# Altium project umouse.PrjPcb
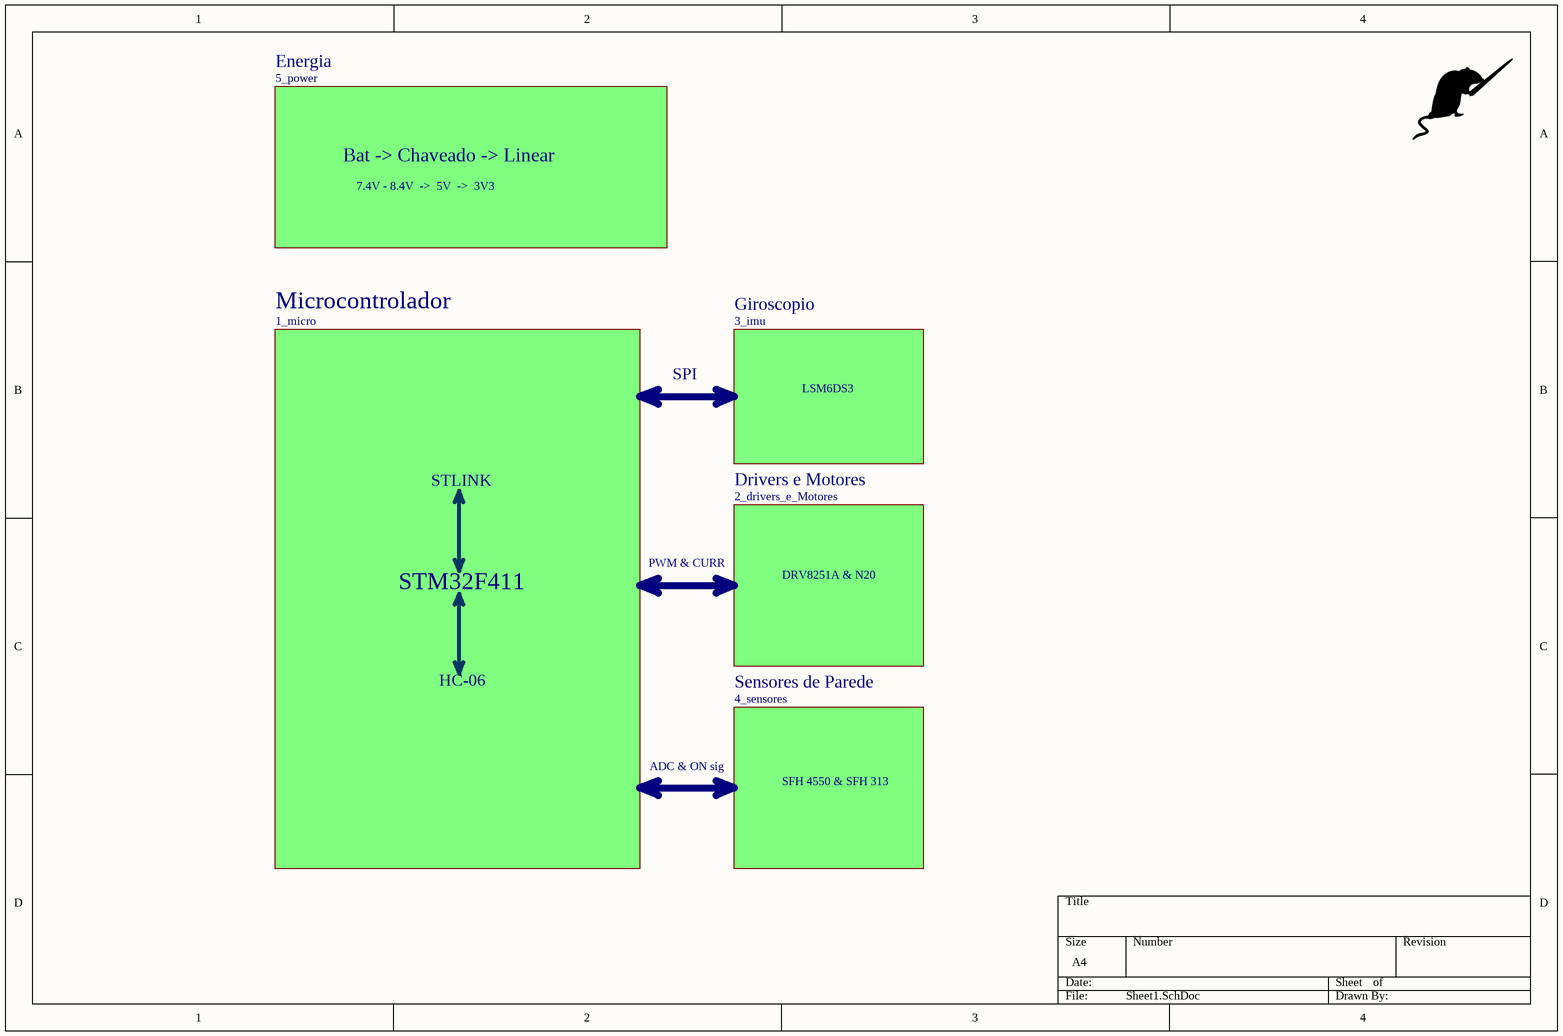
[diagram p0: Sheet1.SchDoc]
6 sheets, 80 parts. Net scope: flat (ports and power ports of the same name join across sheets).
Board files: initial.PcbDoc, atom-pcb.PcbDoc, v2.PcbDoc
Sheets:
  Sheet1.SchDoc
    Drivers e Motores = 2_drivers_e_Motores.SchDoc
    Microcontrolador = 1_micro.SchDoc
    Giroscopio = 3_imu.SchDoc
    Sensores de Parede = 4_sensores.SchDoc
    Energia = 5_power.SchDoc

## Sheet Sheet1.SchDoc
size A4; SheetNumber: 1; SheetTotal: 6

### Sub-sheets
Drivers e Motores = 2_drivers_e_Motores: no entries
Energia = 5_power: no entries
Giroscopio = 3_imu: no entries
Microcontrolador = 1_micro: no entries
Sensores de Parede = 4_sensores: no entries

### Notes on the sheet
- Bat -> Chaveado -> Linear
- 7.4V - 8.4V  ->  5V  ->  3V3
- SPI
- LSM6DS3
- STLINK
- PWM & CURR
- DRV8251A & N20
- STM32F411
- HC-06
- ADC & ON sig
- SFH 4550 & SFH 313

## Sheet 2_drivers_e_Motores.SchDoc: Teseu - Drivers
size A4; DocumentNumber: 2; Revision: 0.1; SheetNumber: 3; SheetTotal: 6
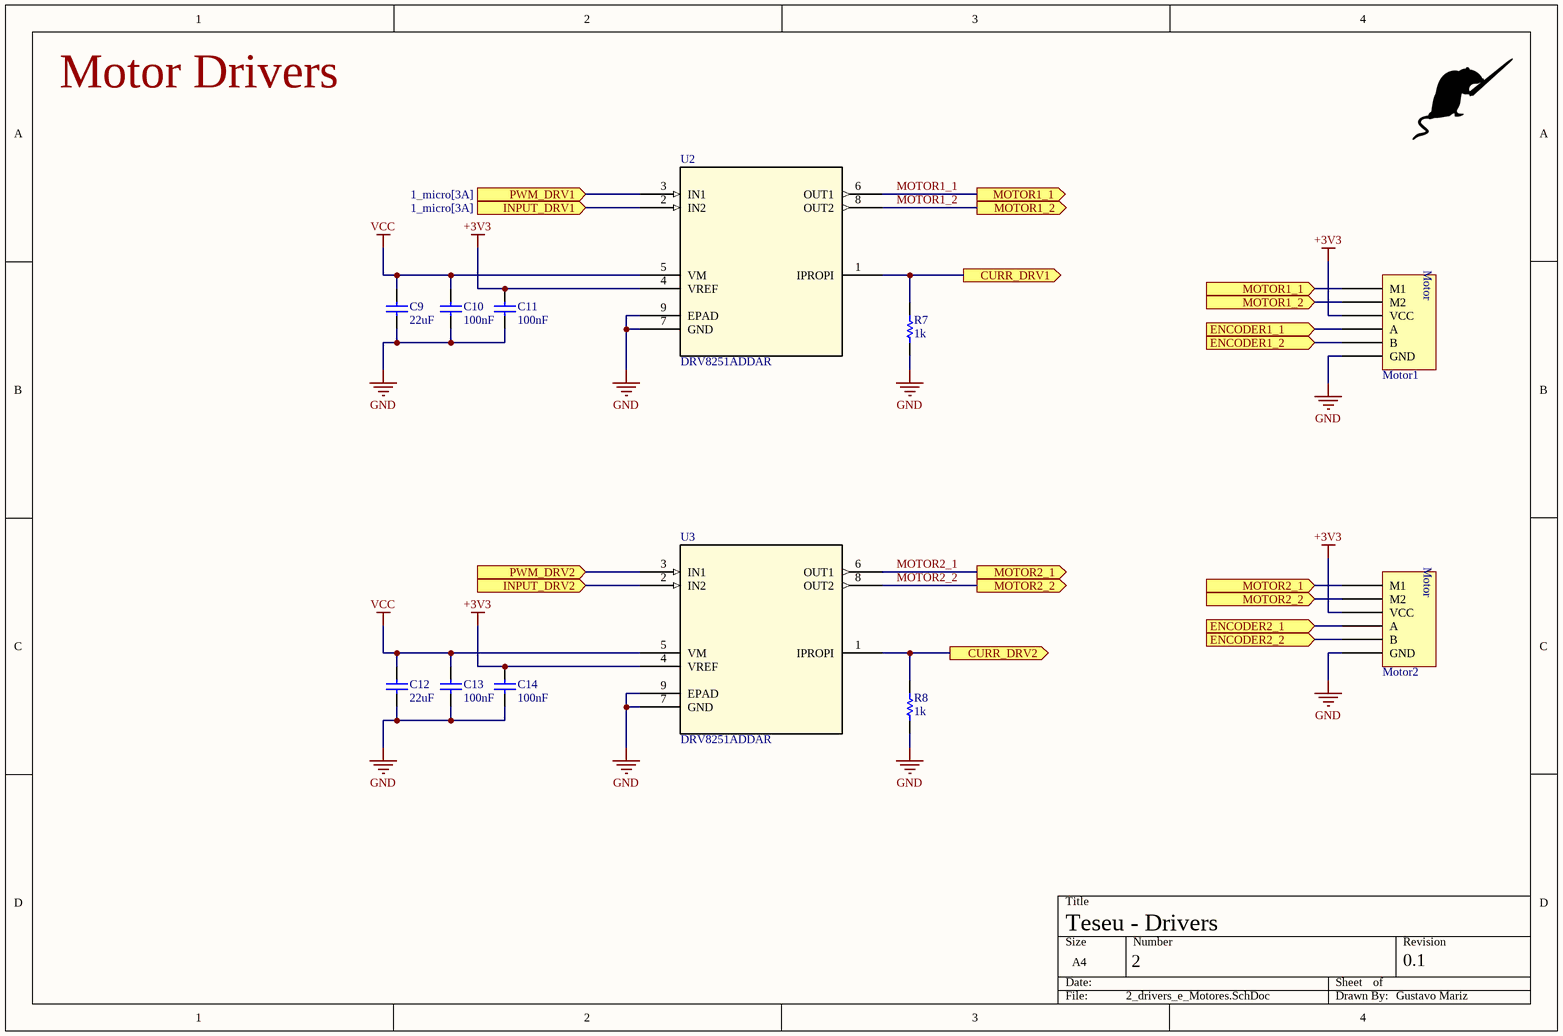
[diagram p1: 2_drivers_e_Motores.SchDoc]

### Parts
C9  Valor: 22uF  [CAP 0805]  (hidden comment: CAP)
C10  Valor: 100nF  [0603]  (hidden comment: CAP)
C11  Valor: 100nF  [0603]  (hidden comment: CAP)
C12  Valor: 22uF  [CAP 0805]  (hidden comment: CAP)
C13  Valor: 100nF  [0603]  (hidden comment: CAP)
C14  Valor: 100nF  [0603]  (hidden comment: CAP)
Motor1  Micro Motor c/ Encoder  [Micro Metal c/ Encoder]  (value not drawn)
Motor2  Micro Motor c/ Encoder  [Micro Metal c/ Encoder]  (value not drawn)
R7  value 1k  [RES 0603]  (hidden comment: RESISTOR)
R8  value 1k  [RES 0603]  (hidden comment: RESISTOR)
U2  DRV8251ADDAR  [SOIC8_DDA_TEX]
U3  DRV8251ADDAR  [SOIC8_DDA_TEX]

### Ports
CURR_DRV1 (out, see 1_micro[2B]), CURR_DRV2 (out, see 1_micro[3A]), ENCODER1_1 (in, see 1_micro[3A]), ENCODER1_2 (in, see 1_micro[2B]), ENCODER2_1 (in, see 1_micro[2A]), ENCODER2_2 (in, see 1_micro[2A]), INPUT_DRV1 (in, see 1_micro[3A]), INPUT_DRV2 (in, see 1_micro[2B]), MOTOR1_1 (in, see 2_drivers_e_Motores[3A]), MOTOR1_1 (out, see 2_drivers_e_Motores[4B]), MOTOR1_2 (in, see 2_drivers_e_Motores[3A]), MOTOR1_2 (out, see 2_drivers_e_Motores[4B]), MOTOR2_1 (in, see 2_drivers_e_Motores[3C]), MOTOR2_1 (out, see 2_drivers_e_Motores[4C]), MOTOR2_2 (in, see 2_drivers_e_Motores[3C]), MOTOR2_2 (out, see 2_drivers_e_Motores[4C]), PWM_DRV1 (in, see 1_micro[3A]), PWM_DRV2 (in, see 1_micro[2B])

### Nets
+3V3: C11.2 C14.2 Motor1.4(VCC) Motor2.4(VCC) U2.4(VREF) U3.4(VREF)
GND: C9.1 C10.1 C11.1 C12.1 C13.1 C14.1 Motor1.1(GND) Motor2.1(GND) R7.1 R8.1 U2.7(GND) U2.9(EPAD) U3.7(GND) U3.9(EPAD)
VCC: C9.2 C10.2 C12.2 C13.2 U2.5(VM) U3.5(VM)
CURR_DRV1: R7.2 U2.1(IPROPI) ; port CURR_DRV1
CURR_DRV2: R8.2 U3.1(IPROPI) ; port CURR_DRV2
ENCODER1_1: Motor1.3(A) ; port ENCODER1_1
ENCODER1_2: Motor1.2(B) ; port ENCODER1_2
ENCODER2_1: Motor2.3(A) ; port ENCODER2_1
ENCODER2_2: Motor2.2(B) ; port ENCODER2_2
INPUT_DRV1: U2.2(IN2) ; port INPUT_DRV1
INPUT_DRV2: U3.2(IN2) ; port INPUT_DRV2
MOTOR1_1: Motor1.6(M1) U2.6(OUT1) ; port MOTOR1_1
MOTOR1_2: Motor1.5(M2) U2.8(OUT2) ; port MOTOR1_2
MOTOR2_1: Motor2.6(M1) U3.6(OUT1) ; port MOTOR2_1
MOTOR2_2: Motor2.5(M2) U3.8(OUT2) ; port MOTOR2_2
PWM_DRV1: U2.3(IN1) ; port PWM_DRV1
PWM_DRV2: U3.3(IN1) ; port PWM_DRV2

### Notes on the sheet
- Motor Drivers
- Gustavo Mariz
- (in symbol Micro Motor c/ Encoder) Motor

### Library data of the parts
C9-C14 = CAP. CERÂMICO: Capacitor; Criador por: Luigi Eduardo; Pertence a: Trincabotz; Criado em: 26/06/2012
U2 U3 = DRV8251ADDAR: No Description Available; Mfr_Name: Texas Instruments; RefDes: RefDes; Type: Type

## Sheet 1_micro.SchDoc: Teseu - MCU
size A4; Author: Gustavo Mariz; CompanyName: Trincabotz; DrawnBy: Gustavo Mariz; Engineer: Gustavo Mariz; Organization: Trincabotz; DocumentNumber: 1; Revision: 0.1; SheetNumber: 2; SheetTotal: 6
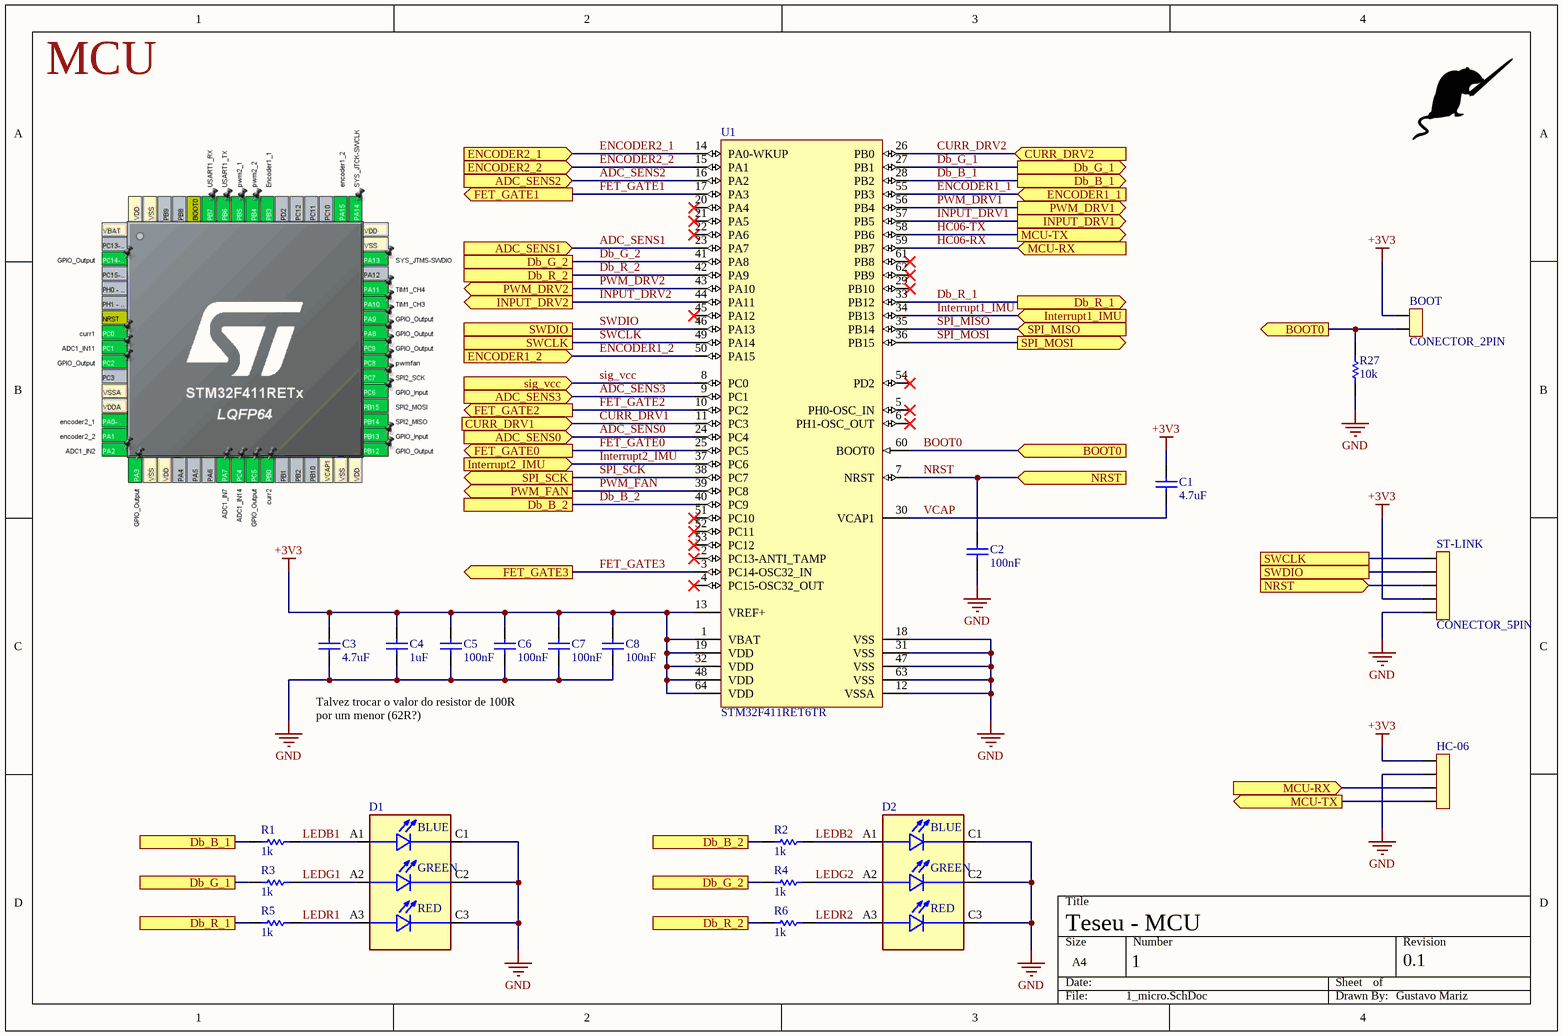
[diagram p2: 1_micro.SchDoc]

### Parts
BOOT  CONECTOR_2PIN  [CON2]
C1  Valor: 4.7uF  [0603]  (hidden comment: CAP)
C2  Valor: 100nF  [0603]  (hidden comment: CAP)
C3  Valor: 4.7uF  [0603]  (hidden comment: CAP)
C4  Valor: 1uF  [0603]  (hidden comment: CAP)
C5  Valor: 100nF  [0603]  (hidden comment: CAP)
C6  Valor: 100nF  [0603]  (hidden comment: CAP)
C7  Valor: 100nF  [0603]  (hidden comment: CAP)
C8  Valor: 100nF  [0603]  (hidden comment: CAP)
D1  KRTBLSLPS1.32-VUVX-EQ+BTBV-D8+TWTZ-L1-B  [LED_KRTBLSLPS1.32-VUVX-EQ+BTBV-D8+TWTZ-L1-B]  (value not drawn)
D2  KRTBLSLPS1.32-VUVX-EQ+BTBV-D8+TWTZ-L1-B  [LED_KRTBLSLPS1.32-VUVX-EQ+BTBV-D8+TWTZ-L1-B]  (value not drawn)
HC-06  (no value)  [CON4]
R1  value 1k  [RES 0603]  (hidden comment: RESISTOR)
R2  value 1k  [RES 0603]  (hidden comment: RESISTOR)
R3  value 1k  [RES 0603]  (hidden comment: RESISTOR)
R4  value 1k  [RES 0603]  (hidden comment: RESISTOR)
R5  value 1k  [RES 0603]  (hidden comment: RESISTOR)
R6  value 1k  [RES 0603]  (hidden comment: RESISTOR)
R27  value 10k  [RES 0805]  (hidden comment: RESISTOR)
ST-LINK  CONECTOR_5PIN  [CON5]
U1  STM32F411RET6TR  [STM-LQFP64_L]

### Ports
ADC_SENS0 (in, see 4_sensores[2B]), ADC_SENS1 (in, see 4_sensores[4B]), ADC_SENS2 (in, see 4_sensores[2C]), ADC_SENS3 (in, see 4_sensores[4C]), BOOT0 (in, see 1_micro[4B]), BOOT0 (out, see 1_micro[3B]), CURR_DRV1 (in, see 2_drivers_e_Motores[3B]), CURR_DRV2 (in, see 2_drivers_e_Motores[3C]), Db_B_1 (out, see 1_micro[1D]), Db_B_1 (see 1_micro[3A]), Db_B_2 (see 1_micro[2B]), Db_B_2 (see 1_micro[2D]), Db_G_1 (out, see 1_micro[1D]), Db_G_1 (see 1_micro[3A]), Db_G_2 (see 1_micro[2B]), Db_G_2 (see 1_micro[2D]), Db_R_1 (out, see 1_micro[1D]), Db_R_1 (see 1_micro[3B]), Db_R_2 (see 1_micro[2B]), Db_R_2 (see 1_micro[2D]), ENCODER1_1 (in, see 2_drivers_e_Motores[4B]), ENCODER1_2 (in, see 2_drivers_e_Motores[4B]), ENCODER2_1 (in, see 2_drivers_e_Motores[4C]), ENCODER2_2 (in, see 2_drivers_e_Motores[4C]), FET_GATE0 (out, see 4_sensores[1B]), FET_GATE1 (out, see 4_sensores[2B]), FET_GATE2 (out, see 4_sensores[1D]), FET_GATE3 (out, see 4_sensores[2D]), INPUT_DRV1 (out, see 2_drivers_e_Motores[2A]), INPUT_DRV2 (out, see 2_drivers_e_Motores[2C]), Interrupt1_IMU (in, see 3_imu[2B]), Interrupt2_IMU (in, see 3_imu[2B]), MCU-RX (in, see 1_micro[3A]), MCU-RX (in, see 1_micro[4D]), MCU-TX (out, see 1_micro[3A]), MCU-TX (out, see 1_micro[4D]), NRST (in, see 1_micro[3B]), NRST (in, see 1_micro[4C]), PWM_DRV1 (out, see 2_drivers_e_Motores[2A]), PWM_DRV2 (out, see 2_drivers_e_Motores[2C]), PWM_FAN (out), sig_vcc (in, see 5_power[2C]), SPI_MISO (in, see 3_imu[3B]), SPI_MOSI (out, see 3_imu[3B]), SPI_SCK (out, see 3_imu[2C]), SWCLK (see 1_micro[2B]), SWCLK (see 1_micro[4C]), SWDIO (see 1_micro[2B]), SWDIO (see 1_micro[4C])

### Nets
+3V3: BOOT.2 C1.2 C3.2 C4.2 C5.2 C6.2 C7.2 C8.2 HC-06.4 ST-LINK.2 U1.1(VBAT) U1.13(VREF+) U1.19(VDD) U1.32(VDD) U1.48(VDD) U1.64(VDD)
GND: C2.1 C3.1 C4.1 C5.1 C6.1 C7.1 C8.1 D1.C1(CATHODE_BLUE) D1.C2(CATHODE_TRUE_GREEN) D1.C3(CATHODE_RED) D2.C1(CATHODE_BLUE) D2.C2(CATHODE_TRUE_GREEN) D2.C3(CATHODE_RED) HC-06.3 R27.1 ST-LINK.1 U1.12(VSSA) U1.18(VSS) U1.31(VSS) U1.47(VSS) U1.63(VSS)
ADC_SENS0: U1.24(PC4) ; port ADC_SENS0
ADC_SENS1: U1.23(PA7) ; port ADC_SENS1
ADC_SENS2: U1.16(PA2) ; port ADC_SENS2
ADC_SENS3: U1.9(PC1) ; port ADC_SENS3
BOOT0: BOOT.1 R27.2 U1.60(BOOT0) ; port BOOT0
CURR_DRV1: U1.11(PC3) ; port CURR_DRV1
CURR_DRV2: U1.26(PB0) ; port CURR_DRV2
Db_B_1: R1.1 U1.28(PB2) ; port Db_B_1
Db_B_2: R2.1 U1.40(PC9) ; port Db_B_2
Db_G_1: R3.1 U1.27(PB1) ; port Db_G_1
Db_G_2: R4.1 U1.41(PA8) ; port Db_G_2
Db_R_1: R5.1 U1.33(PB12) ; port Db_R_1
Db_R_2: R6.1 U1.42(PA9) ; port Db_R_2
ENCODER1_1: U1.55(PB3) ; port ENCODER1_1
ENCODER1_2: U1.50(PA15) ; port ENCODER1_2
ENCODER2_1: U1.14(PA0-WKUP) ; port ENCODER2_1
ENCODER2_2: U1.15(PA1) ; port ENCODER2_2
FET_GATE0: U1.25(PC5) ; port FET_GATE0
FET_GATE1: U1.17(PA3) ; port FET_GATE1
FET_GATE2: U1.10(PC2) ; port FET_GATE2
FET_GATE3: U1.3(PC14-OSC32_IN) ; port FET_GATE3
HC06-RX: HC-06.2 U1.59(PB7) ; port MCU-RX
HC06-TX: HC-06.1 U1.58(PB6) ; port MCU-TX
INPUT_DRV1: U1.57(PB5) ; port INPUT_DRV1
INPUT_DRV2: U1.44(PA11) ; port INPUT_DRV2
Interrupt1_IMU: U1.34(PB13) ; port Interrupt1_IMU
Interrupt2_IMU: U1.37(PC6) ; port Interrupt2_IMU
LEDB1: D1.A1(ANODE_BLUE) R1.2
LEDB2: D2.A1(ANODE_BLUE) R2.2
LEDG1: D1.A2(ANODE_TRUE_GREEN) R3.2
LEDG2: D2.A2(ANODE_TRUE_GREEN) R4.2
LEDR1: D1.A3(ANODE_RED) R5.2
LEDR2: D2.A3(ANODE_RED) R6.2
NRST: C2.2 ST-LINK.3 U1.7(NRST) ; port NRST
PWM_DRV1: U1.56(PB4) ; port PWM_DRV1
PWM_DRV2: U1.43(PA10) ; port PWM_DRV2
PWM_FAN: U1.39(PC8) ; port PWM_FAN
sig_vcc: U1.8(PC0) ; port sig_vcc
SPI_MISO: U1.35(PB14) ; port SPI_MISO
SPI_MOSI: U1.36(PB15) ; port SPI_MOSI
SPI_SCK: U1.38(PC7) ; port SPI_SCK
SWCLK: ST-LINK.5 U1.49(PA14) ; port SWCLK
SWDIO: ST-LINK.4 U1.46(PA13) ; port SWDIO
VCAP: C1.1 U1.30(VCAP1)

Not connected (* = marked no-connect by the designer): U1 2(PC13-ANTI_TAMP)* 4(PC15-OSC32_OUT)* 5(PH0-OSC_IN)* 6(PH1-OSC_OUT)* 20(PA4)* 21(PA5)* 22(PA6)* 29(PB10)* 45(PA12)* 51(PC10)* 52(PC11)* 53(PC12)* 54(PD2)* 61(PB8)* 62(PB9)*

### Notes on the sheet
- MCU
- Talvez trocar o valor do resistor de 100R por um menor (62R?)
- Gustavo Mariz
- (in symbol KRTBLSLPS1.32-VUVX-EQ+BTBV-D8+TWTZ-L1-B) BLUE; GREEN; RED

### Library data of the parts
C1-C8 = CAP. CERÂMICO: as C9 on sheet 2_drivers_e_Motores; Criado em: 26/06/2012
D1 D2 = KRTBLSLPS1.32-VUVX-EQ+BTBV-D8+TWTZ-L1-B: Red, Green, Blue (RGB) 621nm Red, 532nm Green, 467nm Blue LED Indication - Discrete 2.05V Red, 2.65V Green, 2.85V Blue 6-SMD, J-Lead; MF: OSRAM Opto Semiconductors Inc.; Check_prices: https://www.snapeda.com/parts/KRTBLSLPS1.32-VUVX-EQ+BTBV-D8+TWTZ-L1-B/OSRAM+Opto+Semiconductors+Inc./view-part/?ref=eda; SnapEDA_Link: https://www.snapeda.com/parts/KRTBLSLPS1.32-VUVX-EQ+BTBV-D8+TWTZ-L1-B/OSRAM+Opto+Semiconductors+Inc./view-part/?ref=snap; Value: *; Purchase-URL: https://pricing.snapeda.com/search/part/KRTBLSLPS1.32-VUVX-EQ+BTBV-D8+TWTZ-L1-B/?ref=eda; Availability: In Stock; Price: None; MP: KRTBLSLPS1.32-VUVX-EQ+BTBV-D8+TWTZ-L1-B; Package: SMD-6 OSRAM Opto Semiconductors Inc.
HC-06 = CONECTOR_4PIN
U1 = CMP-0243-00169-2: ARM Cortex-M4 32-bit MCU+FPU, 512 KB Flash, 128 KB RAM, 50 I/Os, 64-Pin LQFP, -40 to 85 degC, Tape and Reel; Operating Frequency(F) (Processor speed) (MHz): 100; FLASH Size (Prog) (kB): 512; Supply Voltage(Vcc) min (V): 1.7; Internal RAM Size (kB): 128; I/Os (High Current): 50; Packing: Tape and Reel; ComponentLink1Description: Manufacturer URL; Package Description: LQFP64; DatasheetVersion: Rev. 6; Mounting Technology: Surface Mount; Package Reference: 64-Pin Low-profile Quad Flat Package, Body 10 x 10 mm, Pitch 0.5 mm; ComponentLink2Description: Datasheet; Core: ARM Cortex-M4; ComponentLink2URL: http://www.st.com/st-web-ui/static/active/en/resource/technical/document/datasheet/DM00115249.pdf; ComponentLink1URL: http://www.st.com/

## Sheet 3_imu.SchDoc: Teseu - IMU
size A4; DocumentNumber: 4; Revision: 0.1; SheetNumber: 4; SheetTotal: 6
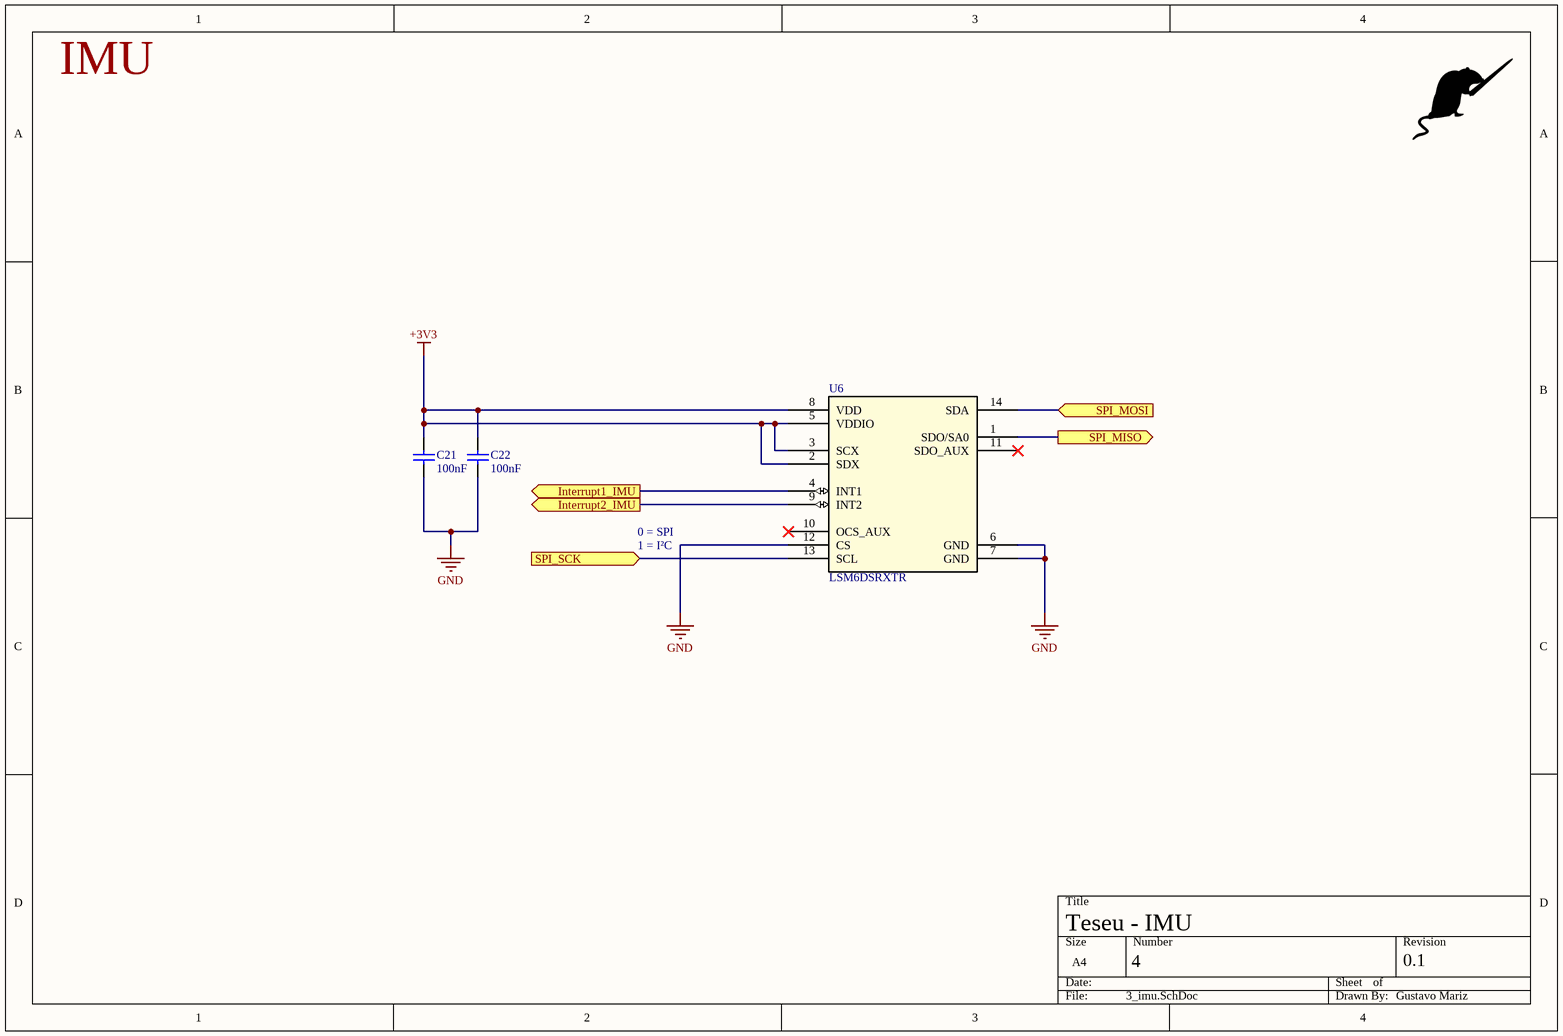
[diagram p3: 3_imu.SchDoc]

### Parts
C21  Valor: 100nF  [0603]  (hidden comment: CAP)
C22  Valor: 100nF  [0603]  (hidden comment: CAP)
U6  LSM6DSRXTR  [LGA-14L_STM]

### Ports
Interrupt1_IMU (out, see 1_micro[2B]), Interrupt2_IMU (out, see 1_micro[2B]), SPI_MISO (out, see 1_micro[2A]), SPI_MOSI (in, see 1_micro[2A]), SPI_SCK (in, see 1_micro[2A])

### Nets
+3V3: C21.2 C22.2 U6.2(SDX) U6.3(SCX) U6.5(VDDIO) U6.8(VDD)
GND: C21.1 C22.1 U6.6(GND) U6.7(GND) U6.12(CS)
Interrupt1_IMU: U6.4(INT1) ; port Interrupt1_IMU
Interrupt2_IMU: U6.9(INT2) ; port Interrupt2_IMU
SPI_MISO: U6.1(SDO/SA0) ; port SPI_MISO
SPI_MOSI: U6.14(SDA) ; port SPI_MOSI
SPI_SCK: U6.13(SCL) ; port SPI_SCK

Not connected (* = marked no-connect by the designer): U6 10(OCS_AUX)* 11(SDO_AUX)*

### Notes on the sheet
- IMU
- 0 = SPI
- 1 = I²C
- Gustavo Mariz

### Library data of the parts
C21 C22 = CAP. CERÂMICO: as C9 on sheet 2_drivers_e_Motores; Criado em: 26/06/2012
U6 = LSM6DSRXTR: No Description Available; Mfr_Name: STMicroelectronics; RefDes: RefDes; Type: Type

## Sheet 4_sensores.SchDoc: Teseu - Sensores
size A4; DocumentNumber: 5; Revision: 0.1; SheetNumber: 5; SheetTotal: 6
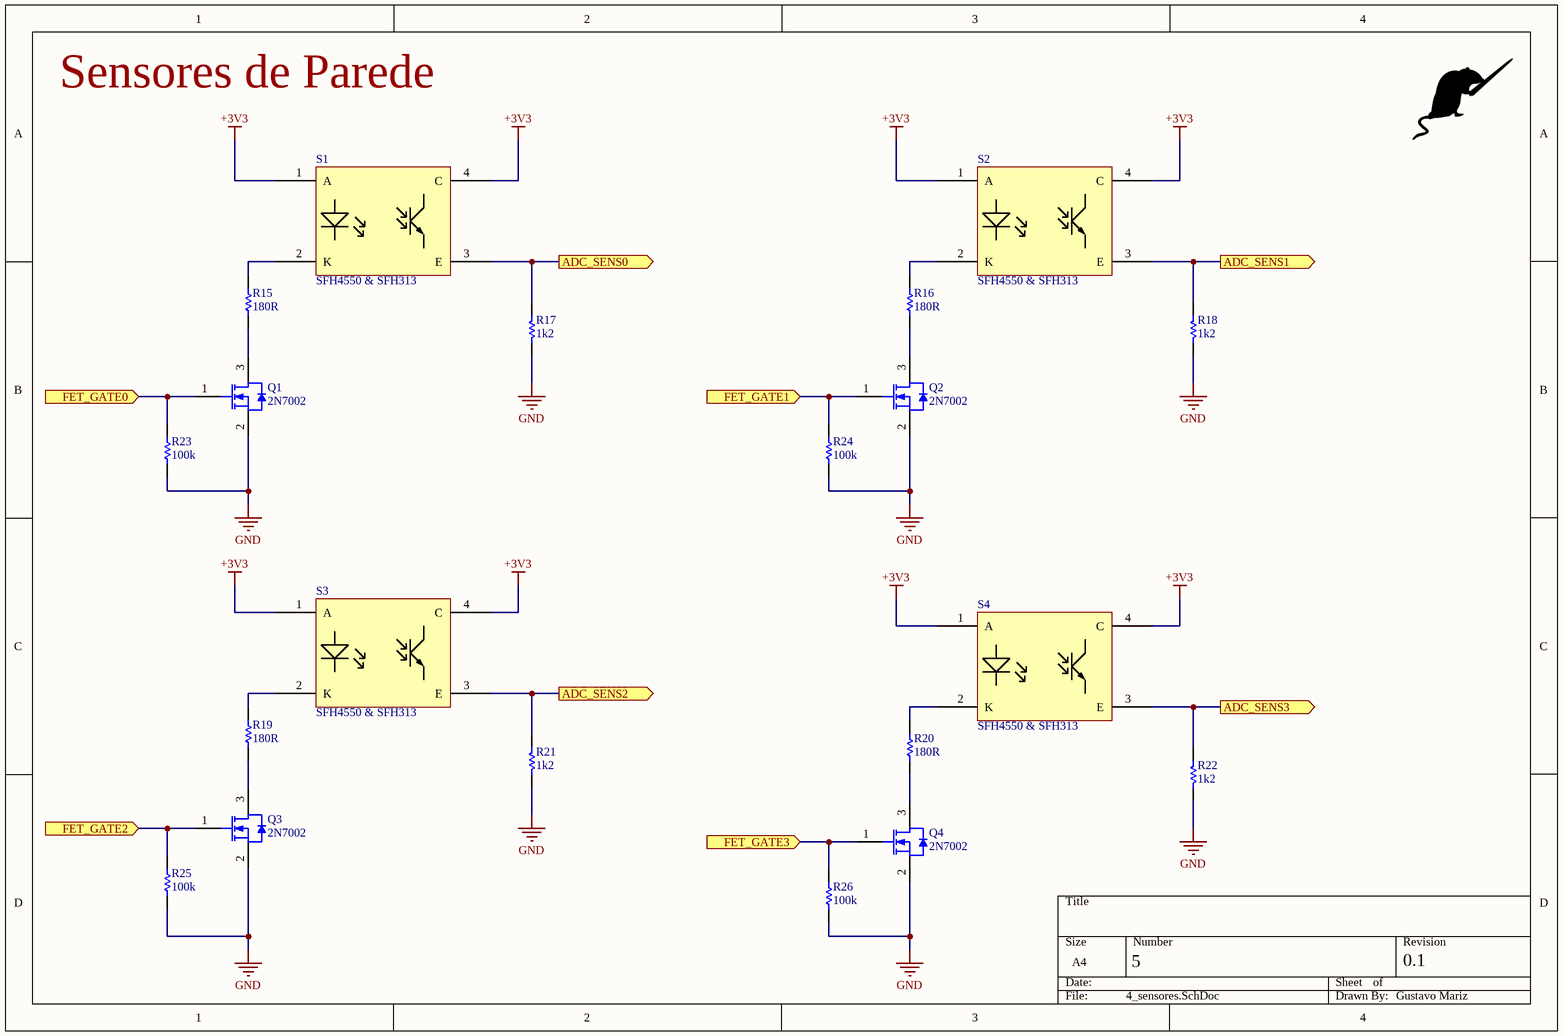
[diagram p4: 4_sensores.SchDoc]

### Parts
Q1  2N7002  [STM-SOT-23-3_V]
Q2  2N7002  [STM-SOT-23-3_V]
Q3  2N7002  [STM-SOT-23-3_V]
Q4  2N7002  [STM-SOT-23-3_V]
R15  value 180R  [RES 0805]  (hidden comment: RESISTOR)
R16  value 180R  [RES 0805]  (hidden comment: RESISTOR)
R17  value 1k2  [RES 0805]  (hidden comment: RESISTOR)
R18  value 1k2  [RES 0805]  (hidden comment: RESISTOR)
R19  value 180R  [RES 0805]  (hidden comment: RESISTOR)
R20  value 180R  [RES 0805]  (hidden comment: RESISTOR)
R21  value 1k2  [RES 0805]  (hidden comment: RESISTOR)
R22  value 1k2  [RES 0805]  (hidden comment: RESISTOR)
R23  value 100k  [RES 0603]  (hidden comment: RESISTOR)
R24  value 100k  [RES 0603]  (hidden comment: RESISTOR)
R25  value 100k  [RES 0603]  (hidden comment: RESISTOR)
R26  value 100k  [RES 0603]  (hidden comment: RESISTOR)
S1  SFH4550 & SFH313  [umouse-sensor-fp]
S2  SFH4550 & SFH313  [umouse-sensor-fp]
S3  SFH4550 & SFH313  [umouse-sensor-fp]
S4  SFH4550 & SFH313  [umouse-sensor-fp]

### Ports
ADC_SENS0 (out, see 1_micro[2B]), ADC_SENS1 (out, see 1_micro[2A]), ADC_SENS2 (out, see 1_micro[2A]), ADC_SENS3 (out, see 1_micro[2B]), FET_GATE0 (in, see 1_micro[2B]), FET_GATE1 (in, see 1_micro[2A]), FET_GATE2 (in, see 1_micro[2B]), FET_GATE3 (in, see 1_micro[2C])

### Nets
+3V3: S1.1(A) S1.4(C) S2.1(A) S2.4(C) S3.1(A) S3.4(C) S4.1(A) S4.4(C)
GND: Q1.2(S) Q2.2(S) Q3.2(S) Q4.2(S) R17.1 R18.1 R21.1 R22.1 R23.1 R24.1 R25.1 R26.1
ADC_SENS0: R17.2 S1.3(E) ; port ADC_SENS0
ADC_SENS1: R18.2 S2.3(E) ; port ADC_SENS1
ADC_SENS2: R21.2 S3.3(E) ; port ADC_SENS2
ADC_SENS3: R22.2 S4.3(E) ; port ADC_SENS3
FET_GATE0: Q1.1(G) R23.2 ; port FET_GATE0
FET_GATE1: Q2.1(G) R24.2 ; port FET_GATE1
FET_GATE2: Q3.1(G) R25.2 ; port FET_GATE2
FET_GATE3: Q4.1(G) R26.2 ; port FET_GATE3
NetQ1_3: Q1.3(D) R15.1
NetQ2_3: Q2.3(D) R16.1
NetQ3_3: Q3.3(D) R19.1
NetQ4_3: Q4.3(D) R20.1
NetR15_2: R15.2 S1.2(K)
NetR16_2: R16.2 S2.2(K)
NetR19_2: R19.2 S3.2(K)
NetR20_2: R20.2 S4.2(K)

### Notes on the sheet
- Sensores de Parede
- Gustavo Mariz

### Library data of the parts
Q1-Q4 = CMP-0434-00001-1: N-channel 60 V, 1.8 Ohm, 0.35 A STripFET(TM) II Power MOSFET, SOT23; Manufacturer: STMicroelectronics; PartNumber: 2N7002; ComponentLink2Description: Datasheet; ComponentLink2URL: http://www.st.com/st-web-ui/static/active/en/resource/technical/document/datasheet/CD00005134.pdf; ComponentLink1Description: Manufacturer URL; ComponentLink1URL: http://www.st.com/; DatasheetVersion: Rev. 9, 11/2008; PackageReference: SOT-23; Mounting Technology: Surface Mount; PackageDescription: 3-Pin SOT23, 3.016 x 2.8 mm Body, 0.95 mm Pitch

## Sheet 5_power.SchDoc: Teseu - Alimentação
size A4; DocumentNumber: 6; Revision: 0.1; SheetNumber: 6; SheetTotal: 6
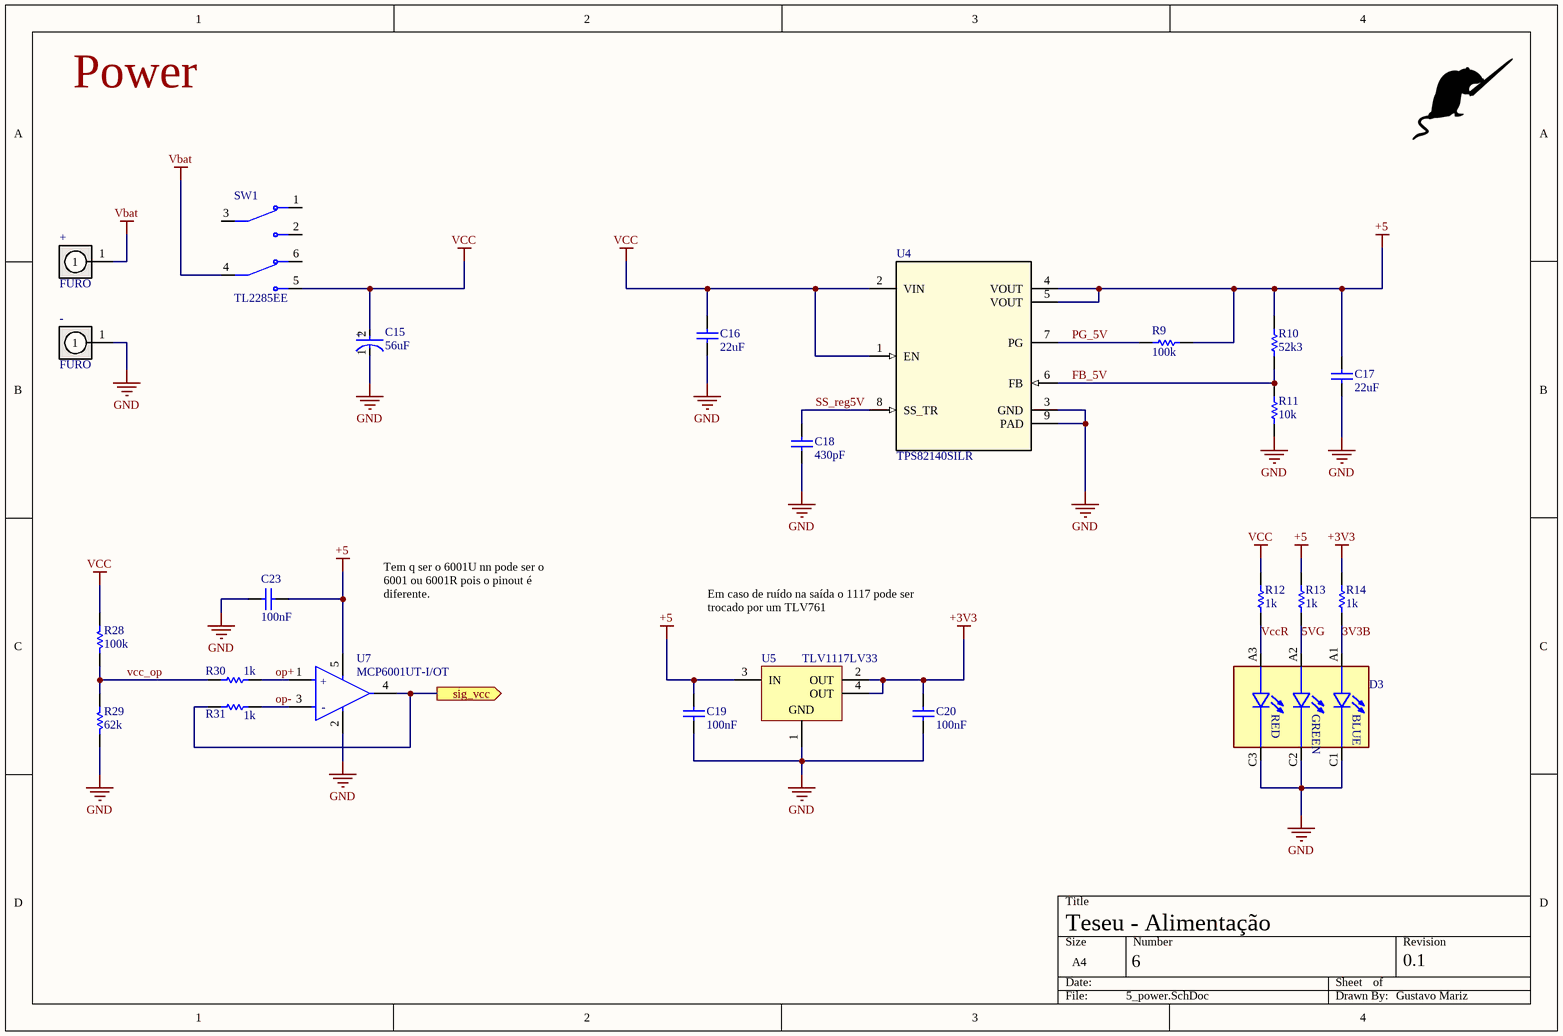
[diagram p5: 5_power.SchDoc]

### Parts
+  FURO  [FURO_2,5MM]
-  FURO  [FURO_2,5MM]
C15  56uF  [FP-PSG-F05-MFG]
C16  Valor: 22uF  [CAP 0805]  (hidden comment: CAP)
C17  Valor: 22uF  [CAP 0805]  (hidden comment: CAP)
C18  Valor: 430pF  [0603]  (hidden comment: CAP)
C19  Valor: 100nF  [0603]  (hidden comment: CAP)
C20  Valor: 100nF  [0603]  (hidden comment: CAP)
C23  Valor: 100nF  [0603]  (hidden comment: CAP)
D3  KRTBLSLPS1.32-VUVX-EQ+BTBV-D8+TWTZ-L1-B  [LED_KRTBLSLPS1.32-VUVX-EQ+BTBV-D8+TWTZ-L1-B]  (value not drawn)
R9  value 100k  [RES 0603]  (hidden comment: RESISTOR)
R10  value 52k3  [RES 0603]  (hidden comment: RESISTOR)
R11  value 10k  [RES 0603]  (hidden comment: RESISTOR)
R12  value 1k  [RES 0603]  (hidden comment: RESISTOR)
R13  value 1k  [RES 0603]  (hidden comment: RESISTOR)
R14  value 1k  [RES 0603]  (hidden comment: RESISTOR)
R28  value 100k  [RES 0603]  (hidden comment: RESISTOR)
R29  value 62k  [RES 0603]  (hidden comment: RESISTOR)
R30  value 1k  [RES 0603]  (hidden comment: RESISTOR)
R31  value 1k  [RES 0603]  (hidden comment: RESISTOR)
SW1  TL2285EE  [SW_TL2285EE]
U4  TPS82140SILR  [SIL0008D_SMD]
U5  TLV1117LV33  [DCY0004A_N]
U7  MCP6001UT-I/OT  [FP-C04-091-OT-IPC_C]

### Ports
sig_vcc (out, see 1_micro[2B])

### Nets
+3V3: C20.2 R14.2 U5.2(OUT) U5.4(OUT)
+5: C17.2 C19.2 C23.2 R9.1 R10.2 R13.2 U4.4(VOUT) U4.5(VOUT) U5.3(IN) U7.5(VDD)
GND: -.1 C15.1(C) C16.1 C17.1 C18.1 C19.1 C20.1 C23.1 D3.C1(CATHODE_BLUE) D3.C2(CATHODE_TRUE_GREEN) D3.C3(CATHODE_RED) R11.1 R29.1 U4.3(GND) U4.9(PAD) U5.1(GND) U7.2(VSS)
Vbat: +.1 SW1.4(COM2)
VCC: C15.2(A) C16.2 R12.2 R28.2 SW1.5(NO2) U4.1(EN) U4.2(VIN)
3V3B: D3.A1(ANODE_BLUE) R14.1
5VG: D3.A2(ANODE_TRUE_GREEN) R13.1
FB_5V: R10.1 R11.2 U4.6(FB)
op+: R30.2 U7.1(VIN+)
op-: R31.2 U7.3(VIN-)
PG_5V: R9.2 U4.7(PG)
sig_vcc: R31.1 U7.4(VOUT) ; port sig_vcc
SS_reg5V: C18.2 U4.8(SS_TR)
vcc_op: R28.1 R29.2 R30.1
VccR: D3.A3(ANODE_RED) R12.1

Not connected (* = marked no-connect by the designer): SW1 1(NC1) 2(NO1) 3(COM1) 6(NC2)

### Notes on the sheet
- Power
- (near U7) Tem q ser o 6001U nn pode ser o 6001 ou 6001R pois o pinout é diferente.
- (near U5) Em caso de ruído na saída o 1117 pode ser trocado por um TLV761
- Gustavo Mariz
- (in symbol CMP-0187-00471-3) +; -
- (in symbol CMP-33769-000002-1) +
- (in symbol KRTBLSLPS1.32-VUVX-EQ+BTBV-D8+TWTZ-L1-B) RED; GREEN; BLUE

### Library data of the parts
+ - = FURO NA PLACA: Criado por: Luigi Eduardo; Pertence a: Trincabotz CEFET-MG; Criado em: 26/06/2012
C15 = CMP-33769-000002-1: CAP ALUM POLY 56UF 20% 25V T/H / APSG250ELL560MF05S / https://www.mouser.com/ProductDetail/Chemi-Con/APSG250ELL560MF05S?qs=nxZbHzLpdvcfhTNzSmDv4w%3D%3D; Manufacturer: United Chemi-Con; Leakage Current: 500uA; Dissipation Factor: 12%; Life: 15000Hours; Ripple Current: 2600mA; Esr: 30mΩ; Material: Polymer; Category: Cap; Temperature Range High: +105°C; Capacitance: 56uF; Temperature: -55°C to +105°C; Octopart: https://octopart.com/apsg250ell560mf05s-united+chemi-con-70515924; ComponentLink2URL: http://www.chemi-con.co.jp/cgi-bin/CAT_DB/SEARCH/cat_db_al.cgi?e=e&j=p&pdfname=psg; Automotive: No; Temperature Range Low: -55°C; Device Class L1: Passive Components; Value: 56uF; Device Class L2: Capacitors; RoHS: TRUE; Digikey Description: CAP ALUM POLY 56UF 20% 25V T/H; Device Class L3: Polymer Capacitors; Height: 6mm; Tolerance: 20%; Package: PSG-F05; ComponentLink2Description: Datasheet; Manufacturer Part Number: APSG250ELL560MF05S; Voltage Rating: 25V; Lead Free: Yes
C16-C20 C23 = CAP. CERÂMICO: as C9 on sheet 2_drivers_e_Motores; Criado em: 26/06/2012
D3 = KRTBLSLPS1.32-VUVX-EQ+BTBV-D8+TWTZ-L1-B: as D1 on sheet 1_micro; Check_prices: https://www.snapeda.com/parts/KRTBLSLPS1.32-VUVX-EQ+BTBV-D8+TWTZ-L1-B/OSRAM+Opto+Semiconductors+Inc./view-part/?ref=eda; SnapEDA_Link: https://www.snapeda.com/parts/KRTBLSLPS1.32-VUVX-EQ+BTBV-D8+TWTZ-L1-B/OSRAM+Opto+Semiconductors+Inc./view-part/?ref=snap; Value: *; Purchase-URL: https://pricing.snapeda.com/search/part/KRTBLSLPS1.32-VUVX-EQ+BTBV-D8+TWTZ-L1-B/?ref=eda; Availability: In Stock; Price: None; MP: KRTBLSLPS1.32-VUVX-EQ+BTBV-D8+TWTZ-L1-B; Package: SMD-6 OSRAM Opto Semiconductors Inc.
U4 = TPS82140SILR: No Description Available; Mfr_Name: Texas Instruments; TYPE: TYPE; RefDes: RefDes
U5 = CMP-0395-00503-2: Single Output LDO, 1 A, Fixed 3.3 V Output, 2 to 5.5 V Input, 4-pin SOT-223 (DCY), -40 to 125 degC, Green (RoHS & no Sb/Br); Manufacturer: Texas Instruments; PartNumber: TLV1117LV33DCYR; Vout Adj(Min)(V): 3.3; Vdo(Typ)(mV): 1200; Iq(Typ)(mA): 0.05; Accuracy(%): 2; Iout(Max)(A): 1; SubFamily: Single Channel LDO; Vin(Max)(V): 5.5; PackageReference: DCY0004A; PackageDescription: 4-Pin Plastic Small Outline, Body 3.5 x 6.5 mm, Pitch 2.3 mm; Vout Adj(Max)(V): 3.3; Mounting Technology: Surface Mount; ComponentLink2Description: Datasheet; ComponentLink1Description: Manufacturer URL; ComponentLink3Description: Package Specification; ComponentLink1URL: http://www.ti.com/; ComponentLink2URL: http://www.ti.com/general/docs/lit/getliterature.tsp?genericPartNumber=TLV1117LV33&fileType=pdf; Fixed Output Options(V): 3.3; PackageVersion: 4202506/B; Vin(Min)(V): 2; DatasheetVersion: SBVS160A; Eco-Plan: Green (RoHS & no Sb/Br); ComponentLink3URL: http://www.ti.com/litv/pdf/mpds094a; Code_JEDEC: TO-261
U7 = CMP-0187-00471-3: IC OPAMP GP 1 CIRCUIT SOT23-5; Nominal Supply Current: 100uA; Unity Gain Bandwidth Product: 1MHz; Voltage Gain: 112dB; Power Supply Rejection Ratio (PSRR): 86dB; Slew Rate: 0.6V/µs; Input Offset Voltage (Vos): 4.5mV; Number of Elements: 1; Min Supply Voltage: 1.8V; Common Mode Rejection Ratio: 60dB; Operating Supply Voltage: 5.5V; Max Frequency: 1kHz; Input Bias Current: 1pA; Max Supply Voltage: 6V; Output Current: 23mA; Width: 1.8mm; Packaging: Tape and Reel; Number of Pins: 5; Height: 1.3mm; Mount: Surface Mount; Lead Free: Lead Free; Bandwidth: 1MHz; Number of Channels: 1; REACH SVHC: No SVHC; Case/Package: SOT-23; Number of Amplifiers: 1; Gain Bandwidth Product: 1MHz; Radiation Hardening: No; Package Quantity: 3000; Length: 3.1mm; Min Operating Temperature: -40°C; Max Operating Temperature: 85°C; Number of Circuits: 1
SW1 = TL2285EE: Value: *; Package: None; Price: None; MP: TL2285EE; Availability: Unavailable

## Nets that join several sheets
+3V3: 2_drivers_e_Motores (6 pins), 1_micro (16 pins), 3_imu (6 pins), 4_sensores (8 pins), 5_power (C20.2 R14.2 U5.2 U5.4)
GND: 2_drivers_e_Motores (14 pins), 1_micro (21 pins), 3_imu (5 pins), 4_sensores (12 pins), 5_power (17 pins)
VCC: 2_drivers_e_Motores (6 pins), 5_power (7 pins)
ADC_SENS0: 1_micro (U1.24), 4_sensores (R17.2 S1.3)
ADC_SENS1: 1_micro (U1.23), 4_sensores (R18.2 S2.3)
ADC_SENS2: 1_micro (U1.16), 4_sensores (R21.2 S3.3)
ADC_SENS3: 1_micro (U1.9), 4_sensores (R22.2 S4.3)
CURR_DRV1: 2_drivers_e_Motores (R7.2 U2.1), 1_micro (U1.11)
CURR_DRV2: 2_drivers_e_Motores (R8.2 U3.1), 1_micro (U1.26)
ENCODER1_1: 2_drivers_e_Motores (Motor1.3), 1_micro (U1.55)
ENCODER1_2: 2_drivers_e_Motores (Motor1.2), 1_micro (U1.50)
ENCODER2_1: 2_drivers_e_Motores (Motor2.3), 1_micro (U1.14)
ENCODER2_2: 2_drivers_e_Motores (Motor2.2), 1_micro (U1.15)
FET_GATE0: 1_micro (U1.25), 4_sensores (Q1.1 R23.2)
FET_GATE1: 1_micro (U1.17), 4_sensores (Q2.1 R24.2)
FET_GATE2: 1_micro (U1.10), 4_sensores (Q3.1 R25.2)
FET_GATE3: 1_micro (U1.3), 4_sensores (Q4.1 R26.2)
INPUT_DRV1: 2_drivers_e_Motores (U2.2), 1_micro (U1.57)
INPUT_DRV2: 2_drivers_e_Motores (U3.2), 1_micro (U1.44)
Interrupt1_IMU: 1_micro (U1.34), 3_imu (U6.4)
Interrupt2_IMU: 1_micro (U1.37), 3_imu (U6.9)
PWM_DRV1: 2_drivers_e_Motores (U2.3), 1_micro (U1.56)
PWM_DRV2: 2_drivers_e_Motores (U3.3), 1_micro (U1.43)
sig_vcc: 1_micro (U1.8), 5_power (R31.1 U7.4)
SPI_MISO: 1_micro (U1.35), 3_imu (U6.1)
SPI_MOSI: 1_micro (U1.36), 3_imu (U6.14)
SPI_SCK: 1_micro (U1.38), 3_imu (U6.13)